# EAGLE schematic UNIOC2 (EAGLE 6.4)
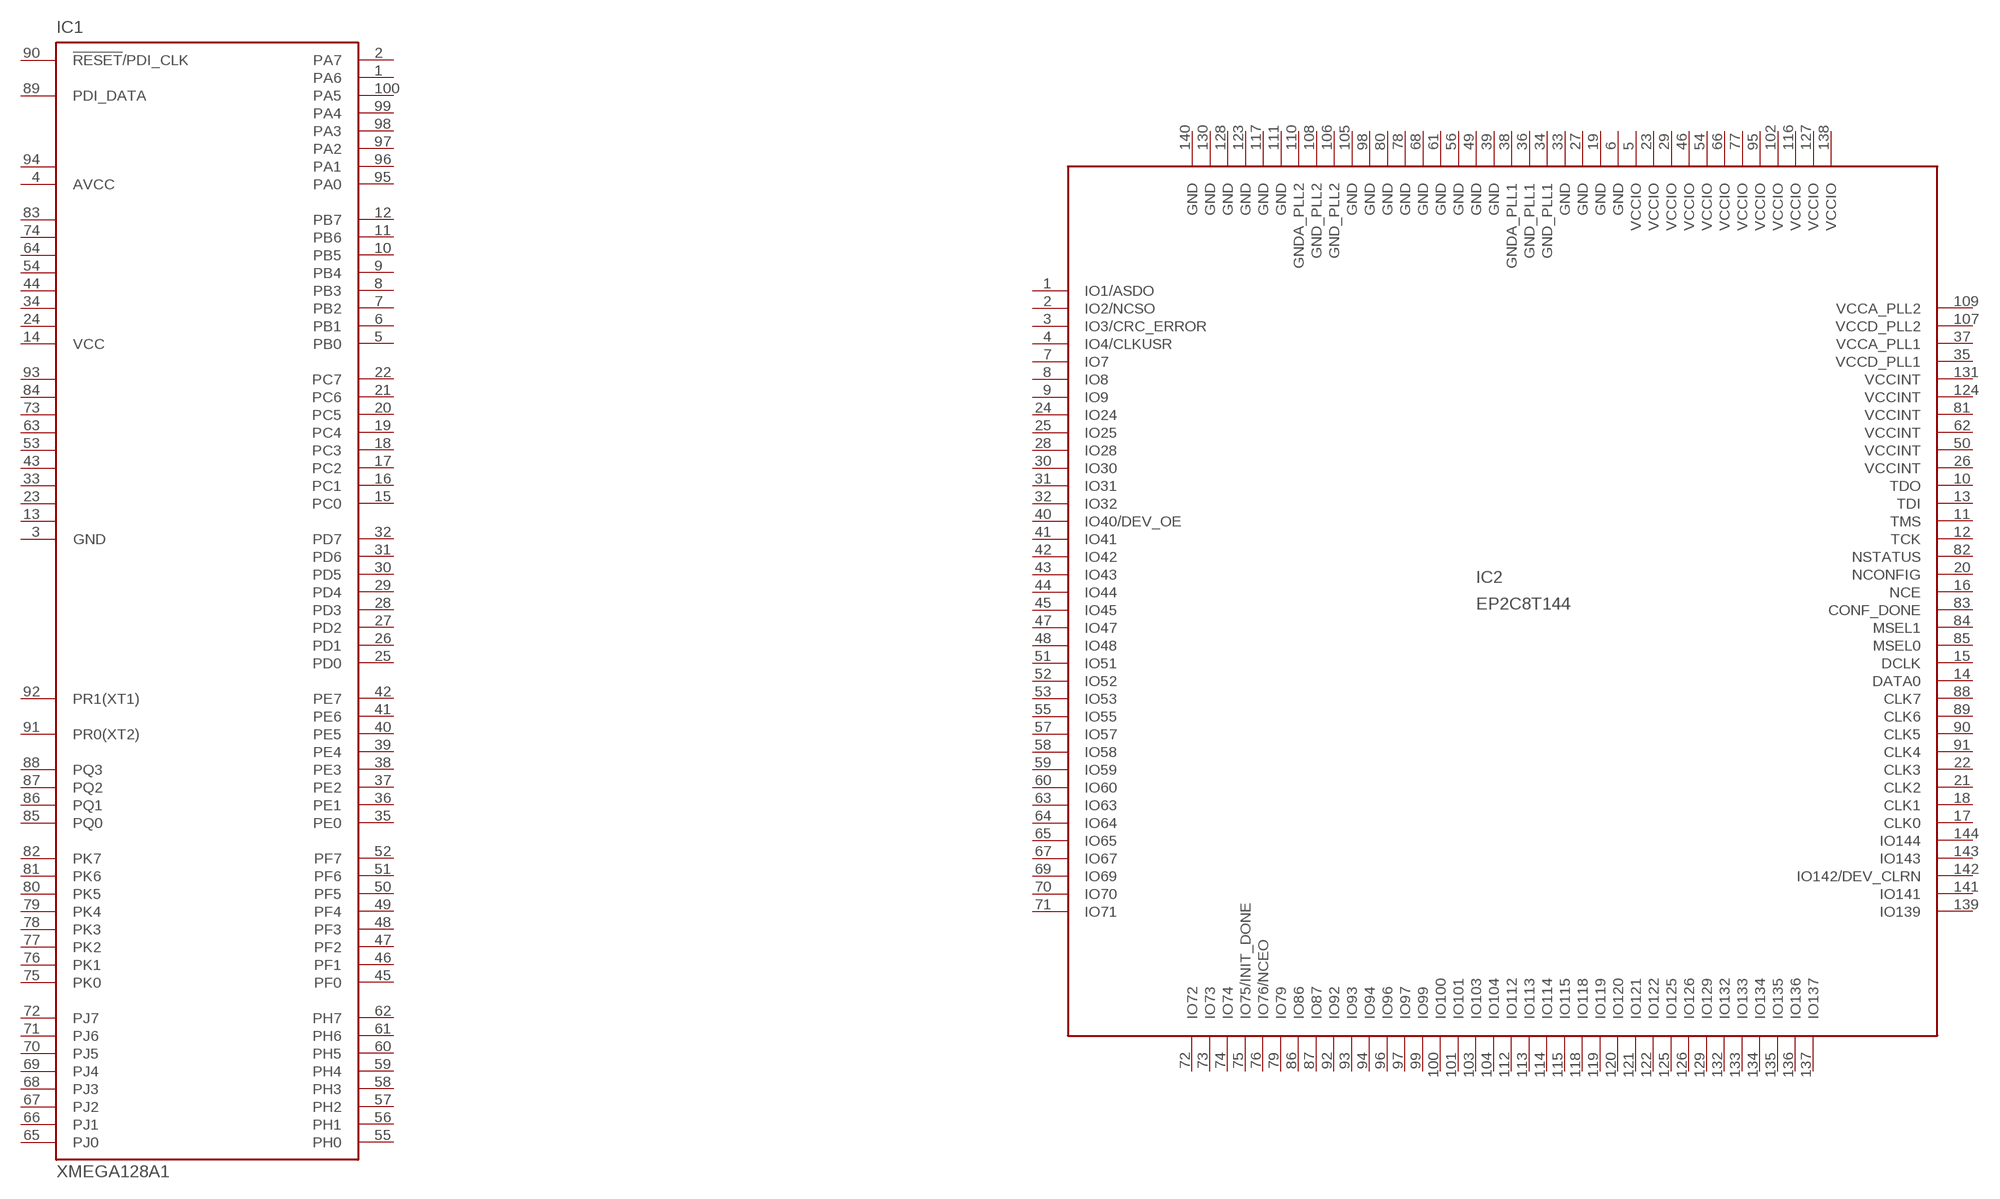
[diagram p0: schematic, sheet 1]

## Parts
IC1  XMEGA128A1  [TQFP100]
IC2  EP2C8T144  [TQFP144]
Unconnected: IC1.1(PA6) IC1.2(PA7) IC1.5(PB0) IC1.6(PB1) IC1.7(PB2) IC1.8(PB3) IC1.9(PB4) IC1.10(PB5) IC1.11(PB6) IC1.12(PB7) IC1.15(PC0) IC1.16(PC1) IC1.17(PC2) IC1.18(PC3) IC1.19(PC4) IC1.20(PC5) IC1.21(PC6) IC1.22(PC7) IC1.25(PD0) IC1.26(PD1) IC1.27(PD2) IC1.28(PD3) IC1.29(PD4) IC1.30(PD5) IC1.31(PD6) IC1.32(PD7) IC1.35(PE0) IC1.36(PE1) IC1.37(PE2) IC1.38(PE3) IC1.39(PE4) IC1.40(PE5) IC1.41(PE6) IC1.42(PE7) IC1.45(PF0) IC1.46(PF1) IC1.47(PF2) IC1.48(PF3) IC1.49(PF4) IC1.50(PF5) IC1.51(PF6) IC1.52(PF7) IC1.55(PH0) IC1.56(PH1) IC1.57(PH2) IC1.58(PH3) IC1.59(PH4) IC1.60(PH5) IC1.61(PH6) IC1.62(PH7) IC1.65(PJ0) IC1.66(PJ1) IC1.67(PJ2) IC1.68(PJ3) IC1.69(PJ4) IC1.70(PJ5) IC1.71(PJ6) IC1.72(PJ7) IC1.75(PK0) IC1.76(PK1) IC1.77(PK2) IC1.78(PK3) IC1.79(PK4) IC1.80(PK5) IC1.81(PK6) IC1.82(PK7) IC1.85(PQ0) IC1.86(PQ1) IC1.87(PQ2) IC1.88(PQ3) IC1.89(PDI_DATA) IC1.90(!RESET!/PDI_CLK) IC1.91(PR0(XT2)) IC1.92(PR1(XT1)) IC1.95(PA0) IC1.96(PA1) IC1.97(PA2) IC1.98(PA3) IC1.99(PA4) IC1.100(PA5) IC2.1(IO1/ASDO) IC2.2(IO2/NCSO) IC2.3(IO3/CRC_ERROR) IC2.4(IO4/CLKUSR) IC2.7(IO7) IC2.8(IO8) IC2.9(IO9) IC2.10(TDO) IC2.11(TMS) IC2.12(TCK) IC2.13(TDI) IC2.14(DATA0) IC2.15(DCLK) IC2.16(NCE) IC2.17(CLK0) IC2.18(CLK1) IC2.20(NCONFIG) IC2.21(CLK2) IC2.22(CLK3) IC2.24(IO24) IC2.25(IO25) IC2.28(IO28) IC2.30(IO30) IC2.31(IO31) IC2.32(IO32) IC2.40(IO40/DEV_OE) IC2.41(IO41) IC2.42(IO42) IC2.43(IO43) IC2.44(IO44) IC2.45(IO45) IC2.47(IO47) IC2.48(IO48) IC2.51(IO51) IC2.52(IO52) IC2.53(IO53) IC2.55(IO55) IC2.57(IO57) IC2.58(IO58) IC2.59(IO59) IC2.60(IO60) IC2.63(IO63) IC2.64(IO64) IC2.65(IO65) IC2.67(IO67) IC2.69(IO69) IC2.70(IO70) IC2.71(IO71) IC2.72(IO72) IC2.73(IO73) IC2.74(IO74) IC2.75(IO75/INIT_DONE) IC2.76(IO76/NCEO) IC2.79(IO79) IC2.82(NSTATUS) IC2.83(CONF_DONE) IC2.84(MSEL1) IC2.85(MSEL0) IC2.86(IO86) IC2.87(IO87) IC2.88(CLK7) IC2.89(CLK6) IC2.90(CLK5) IC2.91(CLK4) IC2.92(IO92) IC2.93(IO93) IC2.94(IO94) IC2.96(IO96) IC2.97(IO97) IC2.99(IO99) IC2.100(IO100) IC2.101(IO101) IC2.103(IO103) IC2.104(IO104) IC2.112(IO112) IC2.113(IO113) IC2.114(IO114) IC2.115(IO115) IC2.118(IO118) IC2.119(IO119) IC2.120(IO120) IC2.121(IO121) IC2.122(IO122) IC2.125(IO125) IC2.126(IO126) IC2.129(IO129) IC2.132(IO132) IC2.133(IO133) IC2.134(IO134) IC2.135(IO135) IC2.136(IO136) IC2.137(IO137) IC2.139(IO139) IC2.141(IO141) IC2.142(IO142/DEV_CLRN) IC2.143(IO143) IC2.144(IO144)

## Power pins joined to a net without a drawn wire
AVCC: IC1.4(AVCC)
AVCC1: IC1.94(AVCC1)
GND: IC1.3(GND) IC2.6(GND) IC2.19(GND) IC2.27(GND) IC2.33(GND) IC2.39(GND) IC2.49(GND) IC2.56(GND) IC2.61(GND) IC2.68(GND) IC2.78(GND) IC2.80(GND) IC2.98(GND) IC2.105(GND) IC2.111(GND) IC2.117(GND) IC2.123(GND) IC2.128(GND) IC2.130(GND) IC2.140(GND)
GND1: IC1.13(GND1)
GND2: IC1.23(GND2)
GND3: IC1.33(GND3)
GND4: IC1.43(GND4)
GND5: IC1.53(GND5)
GND6: IC1.63(GND6)
GND7: IC1.73(GND7)
GND8: IC1.84(GND8)
GND9: IC1.93(GND9)
GND_PLL1: IC2.34(GND_PLL1) IC2.36(GND_PLL1)
GND_PLL2: IC2.106(GND_PLL2) IC2.108(GND_PLL2)
GNDA_PLL1: IC2.38(GNDA_PLL1)
GNDA_PLL2: IC2.110(GNDA_PLL2)
VCC: IC1.14(VCC)
VCC1: IC1.24(VCC1)
VCC2: IC1.34(VCC2)
VCC3: IC1.44(VCC3)
VCC4: IC1.54(VCC4)
VCC5: IC1.64(VCC5)
VCC6: IC1.74(VCC6)
VCC7: IC1.83(VCC7)
VCCA_PLL1: IC2.37(VCCA_PLL1)
VCCA_PLL2: IC2.109(VCCA_PLL2)
VCCD_PLL1: IC2.35(VCCD_PLL1)
VCCD_PLL2: IC2.107(VCCD_PLL2)
VCCINT: IC2.26(VCCINT) IC2.50(VCCINT) IC2.62(VCCINT) IC2.81(VCCINT) IC2.124(VCCINT) IC2.131(VCCINT)
VCCIO: IC2.5(VCCIO) IC2.23(VCCIO) IC2.29(VCCIO) IC2.46(VCCIO) IC2.54(VCCIO) IC2.66(VCCIO) IC2.77(VCCIO) IC2.95(VCCIO) IC2.102(VCCIO) IC2.116(VCCIO) IC2.127(VCCIO) IC2.138(VCCIO)

## Library data of the parts
IC1 = atmel:XMEGA128A1: MICROCONTROLLER Features High-performance, Low-power 8/16-bit AVR XMEGA Microcontroller Non-Volatile Program and Data Memories - 64K - 384K Bytes of In-System Self-Programmable Flash - 4K - 8K Bytes Boot Section with Independent Lock Bits - 2 KB - 4 KB EEPROM - 4 KB - 32 KB Internal SRAM External Bus Interface for up to 16M bytes SRAM External Bus Interface for up to 128M bit SDRAM Peripheral Features - Four-channel DMA Controller with support for external requests - Eight-channel Event System - Eight 16-bit Timer/Counters Four Timer/Counters with 4 Output Compare or Input Capture channels Four Timer/Counters with 2 Output Compare or Input Capture channels High-Resolution Extension on all Timer/Counters Advanced Waveform Extension on two Timer/Counters - Eight USARTs IrDA modulation/demodulation for one USART - Four Two-Wire Interfaces with dual address match (I2C and SMBus compatible) - Four SPI (Serial Peripheral Interface) peripherals - AES and DES Crypto Engine - 16-bit Real Time Counter with separate Oscillator - Two Eight-channel, 12-bit, 2 Msps Analog to Digital Converters - Two Two-channel, 12-bit, 1 Msps Digital to Analog Converters - Four Analog Comparators with Window compare function - External Interrupts on all General Purpose I/O pins - Programmable Watchdog Timer with Separate On-chip Ultra Low Power Oscillator Special Microcontroller Features - Power-on Reset and Programmable Brown-out Detection - Internal and External Clock Options with PLL and Prescaler - Programmable Multi-level Interrupt Controller - Sleep Modes: Idle, Power-down, Standby, Power-save, Extended Standby - Advanced Programming, Test and Debugging Interfaces JTAG (IEEE 1149.1 Compliant) Interface for programming, test and debugging PDI (Program and Debug Interface) for programming and debugging I/O and Packages - 78 Programmable I/O Lines - 100 - lead TQFP - 100 - ball CBGA - 100 - ball VFBGA Operating Voltage - 1.6 - 3.6V Speed performance - 0 - 12 MHz @ 1.6 - 3.6V - 0 - 32 MHz @ 2.7 - 3.6V Drawn by Dipl.-Ing. (FH) Robert Siegler Created: 27.05.09; OC_FARNELL: unknown; OC_NEWARK: unknown
IC2 = robotter_ic:EP2C8T144: EP2C8T144 manualy modified from altera library